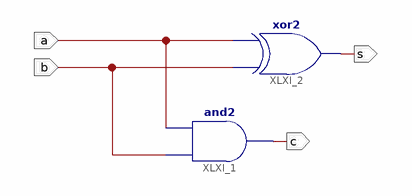
[diagram p0: schematic sheet 1]
// Xilinx ISE schematic HA.sch (spartan6) as structural Verilog: 2 symbols, 4 ports
module HA (
  input  b,
  input  a,
  output s,
  output c
);

  and XLXI_1 (c, b, a);
  xor XLXI_2 (s, b, a);
endmodule
